# EAGLE design pcb (EAGLE 8.7.1)
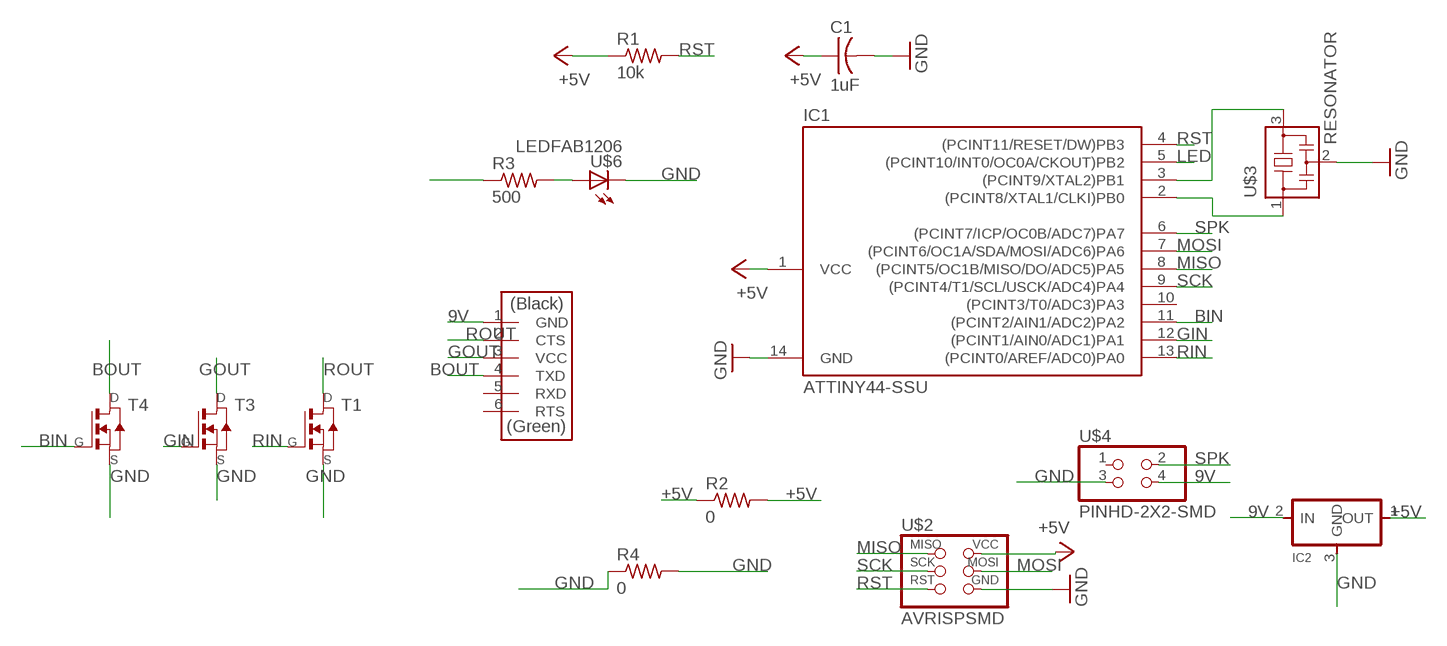
[diagram p0: schematic, sheet 1]

## Parts
C1  1uF  CAP-US1206FAB  [C1206FAB]
IC1  ATTINY44-SSU  [SOIC14]
IC2  REGULATORSOT23  [SOT23]
R1  10k  RES-US1206FAB  [R1206FAB]
R2  0  RES-US1206FAB  [R1206FAB]
R3  500  RES-US1206FAB  [R1206FAB]
R4  0  RES-US1206FAB  [R1206FAB]
T1  NMOSFETSOT23  [SOT-23]
T3  NMOSFETSOT23  [SOT-23]
T4  NMOSFETSOT23  [SOT-23]
U$1  FTDI-SMD-HEADER  [1X06SMD]
U$2  AVRISPSMD  [2X03SMD]
U$3  RESONATOR  [EFOBM]
U$4  PINHD-2X2-SMD  [2X02SMD]
U$6  LEDFAB1206  [LED1206FAB]

## Nets
9V: IC2.2(IN) U$1.1(GND) U$4.4
+5V: C1.1 IC1.1(VCC) IC2.1(OUT) R1.1 R2.1 R2.2 U$2.2(VCC)
BIN: IC1.11((PCINT2/AIN1/ADC2)PA2) T4.3(G)
BOUT: T4.1(D) U$1.4(TXD)
GIN: IC1.12((PCINT1/AIN0/ADC1)PA1) T3.3(G)
GND: C1.2 IC1.14(GND) IC2.3(GND) R4.1 R4.2 T1.2(S) T3.2(S) T4.2(S) U$2.6(GND) U$3.2 U$4.3 U$6.2(C)
GOUT: T3.1(D) U$1.3(VCC)
LED: IC1.5((PCINT10/INT0/OC0A/CKOUT)PB2) R3.1
MISO: IC1.8((PCINT5/OC1B/MISO/DO/ADC5)PA5) U$2.1(MISO)
MOSI: IC1.7((PCINT6/OC1A/SDA/MOSI/ADC6)PA6) U$2.4(MOSI)
N$1: IC1.3((PCINT9/XTAL2)PB1) U$3.3
N$2: IC1.2((PCINT8/XTAL1/CLKI)PB0) U$3.1
N$3: R3.2 U$6.1(A)
RIN: IC1.13((PCINT0/AREF/ADC0)PA0) T1.3(G)
ROUT: T1.1(D) U$1.2(CTS)
RST: IC1.4((PCINT11/RESET/DW)PB3) R1.2 U$2.5(RST)
SCK: IC1.9((PCINT4/T1/SCL/USCK/ADC4)PA4) U$2.3(SCK)
SPK: IC1.6((PCINT7/ICP/OC0B/ADC7)PA7) U$4.2
Unconnected: IC1.10((PCINT3/T0/ADC3)PA3) U$1.5(RXD) U$1.6(RTS) U$4.1

## Library data of the parts
C1 = fab:CAP-US
IC1 = fab:ATTINY44
IC2 = fab:REGULATOR
R1-R4 = fab:RES-US: Resistor (US Symbol) Variants with postfix FAB are widened to allow the routing of internal traces
T1 T3 T4 = fab:NMOSFET: MOS FET
U$1 = fab:FTDI-SMD-HEADER
U$2 = fab:AVRISP
U$3 = fab:RESONATOR
U$4 = fab:PINHD-2X2-SMD
U$6 = fab:LED: LED

## Board
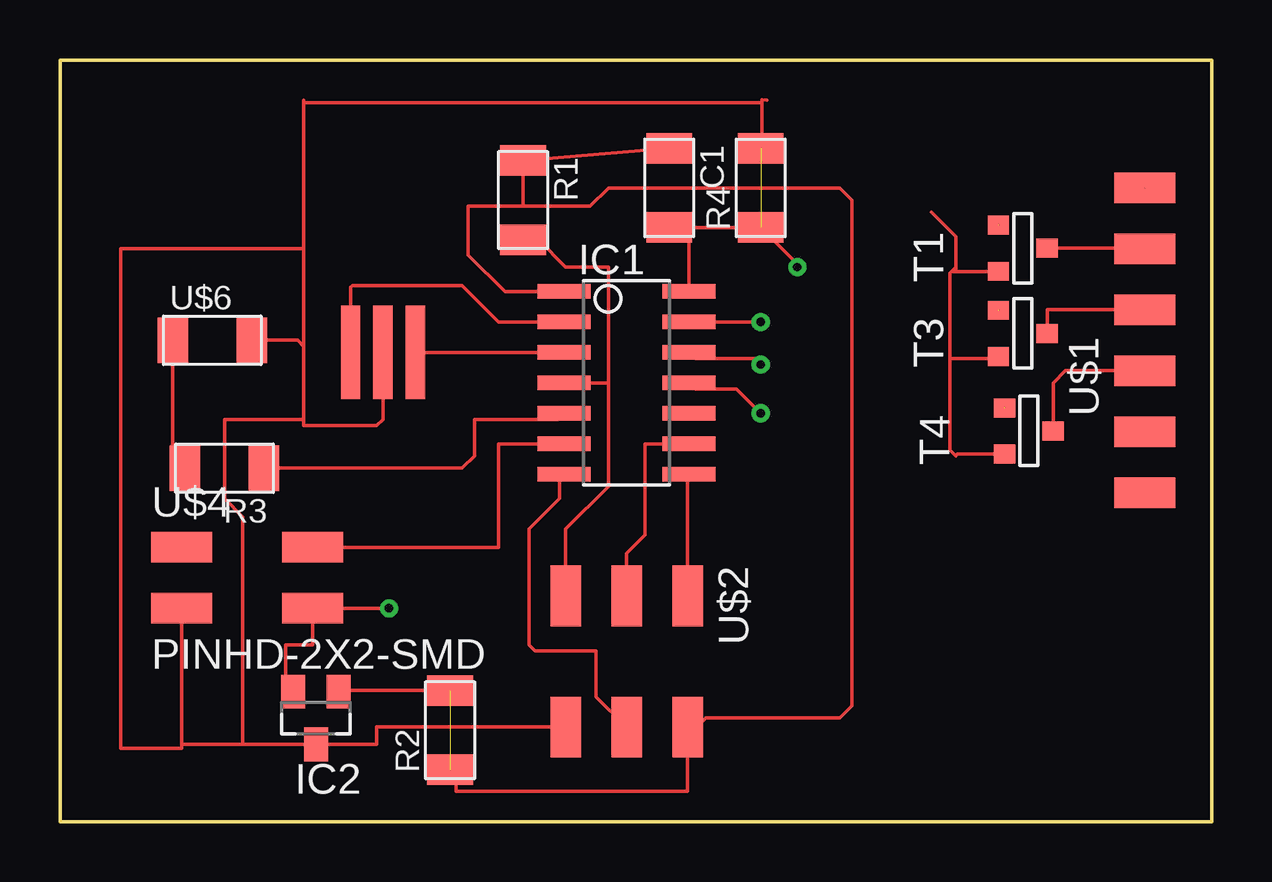
[diagram p1: board, top side]
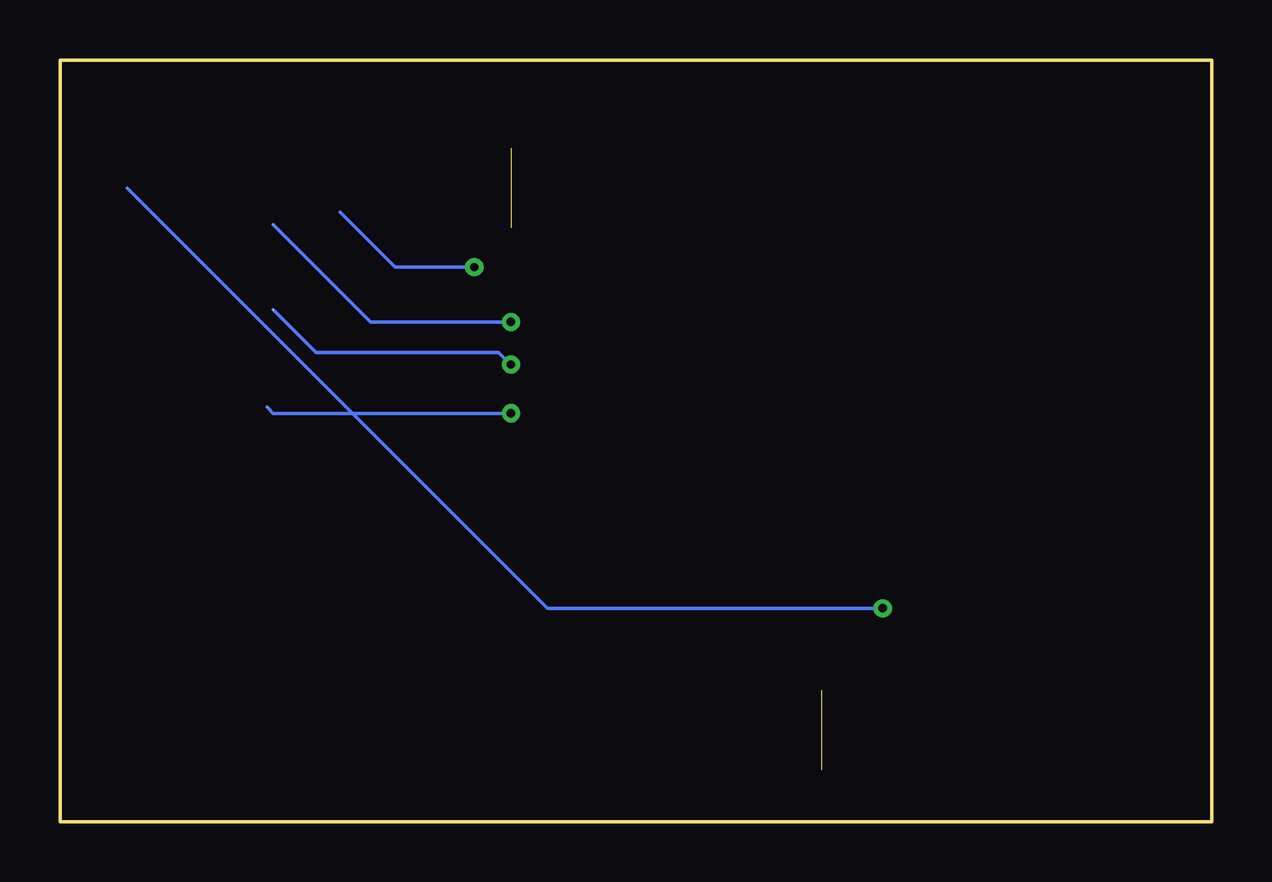
[diagram p2: board, bottom side, seen from below]

Size 48.01 x 31.75 mm. Coordinates in mm from the lower left corner, seen from the top.
Outline: 0,31.75 48.01,31.75 48.01,0 0,0 0,31.75
Copper layers (1*16): Top 0.035mm / dielectric 1.5mm / Bottom 0.035mm
Design rules "default": minimum track width 6mil, minimum drill 0.35mm, track to track 6mil, track to pad 6mil, pad to pad 6mil, via to via 6mil, smd to smd 6mil, copper to edge 40mil, drill to drill 6mil, minimum pad ring 10mil, minimum via ring 8mil, stop-mask expansion 4mil, vias tented up to drill 0mil, thermal gap 10mil

### Footprints (pad centres in the part's own frame; a part is rotated, then mirrored left to right if it is on the bottom)
C1206FAB = smd 1.27 x 1.905: 1 -1.651,0; 2 1.651,0
SOIC14 = smd 0.61 x 2.21: 1 -3.81,-2.603; 2 -2.54,-2.603; 3 -1.27,-2.603; 4 0,-2.603; 5 1.27,-2.603; 6 2.54,-2.603; 7 3.81,-2.603; 8 3.81,2.603; 9 2.54,2.603; 10 1.27,2.603; 11 0,2.603; 12 -1.27,2.603; 13 -2.54,2.603; 14 -3.81,2.603
SOT23 = smd 1 x 1.4: 1 -0.95,-1.1; 2 0.95,-1.1; 3 0,1.1
R1206FAB = smd 1.27 x 1.905: 1 -1.651,0; 2 1.651,0
SOT-23 = smd 0.787 x 0.889: 1 0.025,-1.016; 2 -0.94,1.016; 3 0.991,1.016
1X06SMD = smd 2.54 x 1.27: 1 0,6.35; 2 0,3.81; 3 0,1.27; 4 0,-1.27; 5 0,-3.81; 6 0,-6.35
2X03SMD = smd 2.54 x 1.27: 1 -2.54,2.54; 2 2.92,2.54; 3 -2.54,0; 4 2.92,0; 5 -2.54,-2.54; 6 2.92,-2.54
EFOBM = smd 0.8 x 3.9: 1 -1.35,0; 2 0,0; 3 1.35,0
2X02SMD = smd 2.54 x 1.27: 1 -2.54,1.27; 2 2.92,1.27; 3 -2.54,-1.27; 4 2.92,-1.27
LED1206FAB = smd 1.27 x 1.905: 1 -1.651,0; 2 1.651,0

### Placement (x,y rotation side)
C1  25.4,26.42 270 top
IC1  23.62,18.29 270 top
IC2  10.67,4.32 180 top
R1  19.3,25.91 270 top
R2  16.26,3.81 90 top
R3  6.86,14.73 180 top
R4  29.21,26.42 90 top
T1  40.13,23.88 90 top
T3  40.13,20.32 90 top
T4  40.39,16.26 90 top
U$1  45.21,20.07 0 top
U$2  23.62,6.86 270 top
U$3  13.46,19.56 0 top
U$4  7.62,10.16 0 top
U$6  6.35,20.07 0 top

### Tracks (layer width: path | path; a pad name or v marks a point on that pad's centre or on a via)
9V  (via drill 0.35)  (1 unrouted)
  Top 0.152: IC2.2 9.4,5.42 9.4,7.37 10.54,7.37 U$4.4 v13.72,8.89
  Bottom 0.152: v13.72,8.89 27.69,8.89 U$1.1
+5V  (1 unrouted)
  Top 0.152: C1.1 R1.1 19.3,25.65 | U$2.2 26.16,3.56 | 26.16,3.56 26.16,1.27 16.51,1.27 16.51,2.16 R2.1 | R2.2 11.62,5.46 IC2.1 | IC1.1 18.54,22.1 17.02,23.62 17.02,25.65 19.3,25.65 | 19.3,25.65 22.1,25.65 22.86,26.42 32.51,26.42 33.02,25.91 33.02,4.83 32.51,4.32 26.92,4.32 26.16,3.56
BIN  (via drill 0.35)  (1 unrouted)
  Top 0.152: IC1.11 26.48,18.03 28.19,18.03 v29.21,17.02 29.21,16.76
  Bottom 0.152: v29.21,17.02 39.12,17.02 39.37,17.27
BOUT
  Top 0.152: T4.1 41.4,18.29 41.91,18.8 U$1.4
GIN  (via drill 0.35)  (1 unrouted)
  Top 0.152: IC1.12 26.48,19.3 29.21,19.3 v29.21,19.05
  Bottom 0.152: v29.21,19.05 29.72,19.56 37.34,19.56 39.12,21.34
GND  (via drill 0.35)  (2 unrouted)
  Top 0.152: U$3.2 13.46,16.76 13.21,16.51 10.16,16.51 10.16,16.76 | 10.16,19.81 9.91,20.07 U$6.2 | 10.16,23.88 10.16,19.81 | 29.48,30.06 29.26,30.09 29.26,29.97 | U$2.6 13.21,3.94 13.21,3.22 IC2.3 7.62,3.22 | 5.08,3.22 U$4.3 | 7.62,3.22 5.08,3.22 | 10.16,19.81 10.16,16.76 | 10.16,16.76 6.86,16.76 6.86,13.46 7.62,12.7 7.62,3.22 | 25.9,24.46 C1.2 | 25.9,24.46 26.23,24.26 IC1.14 | 10.16,23.88 2.54,23.88 2.54,3.05 5.08,3.05 5.08,3.22 | 25.9,24.46 25.9,24.77 R4.1 30.73,23.24 v30.73,23.11 | R4.2 29.26,28.07 29.26,29.97 | 10.16,30.06 10.16,29.97 | 10.16,29.97 10.16,23.88 | 10.16,29.97 29.26,29.97 | 37.34,23.11 37.16,22.94 | 37.08,19.3 37.08,22.86 37.16,22.94 | 37.08,19.3 39.04,19.3 T3.2 | 37.08,19.3 37.08,15.49 37.34,15.24 37.41,15.32 T4.2 | T1.2 37.34,22.94 | 37.34,22.94 37.16,22.94 | 37.34,22.94 37.34,24.38 36.32,25.4
  Bottom 0.152: v30.73,23.11 34.04,23.11 36.32,25.4
GOUT
  Top 0.152: T3.1 41.15,21.34 U$1.3
LED
  Top 0.152: 20.77,16.76 IC1.5 20.77,16.76 | R3.1 16.76,14.73 17.27,15.24 17.27,16.76 20.77,16.76
MISO
  Top 0.152: IC1.8 26.16,14.41 U$2.1
MOSI
  Top 0.152: U$2.4 22.35,5.21 22.35,7.11 19.81,7.11 19.56,7.37 19.56,12.19 20.83,13.46 20.83,14.29 IC1.7
N$1
  Top 0.152: IC1.3 U$3.3
N$2
  Top 0.152: U$3.1 12.11,22.27 12.19,22.35 16.76,22.35 18.29,20.83 IC1.2
N$3
  Top 0.152: U$6.1 4.7,15.24 R3.2
RIN  (via drill 0.35)  (1 unrouted)
  Top 0.152: IC1.13 v29.21,20.83
  Bottom 0.152: v29.21,20.83 35.05,20.83 39.12,24.89
ROUT
  Top 0.152: T1.1 45.19,23.9 U$1.2
RST
  Top 0.152: U$2.5 21.08,12.19 22.86,13.97 22.86,18.29 | 22.86,18.29 IC1.4 | 22.86,18.29 22.86,23.11 21.08,23.11 19.94,24.26 R1.2
SCK
  Top 0.152: IC1.9 24.38,15.75 24.38,11.94 23.62,11.18 U$2.3
SPK
  Top 0.152: IC1.6 18.29,15.75 18.29,11.43 U$4.2